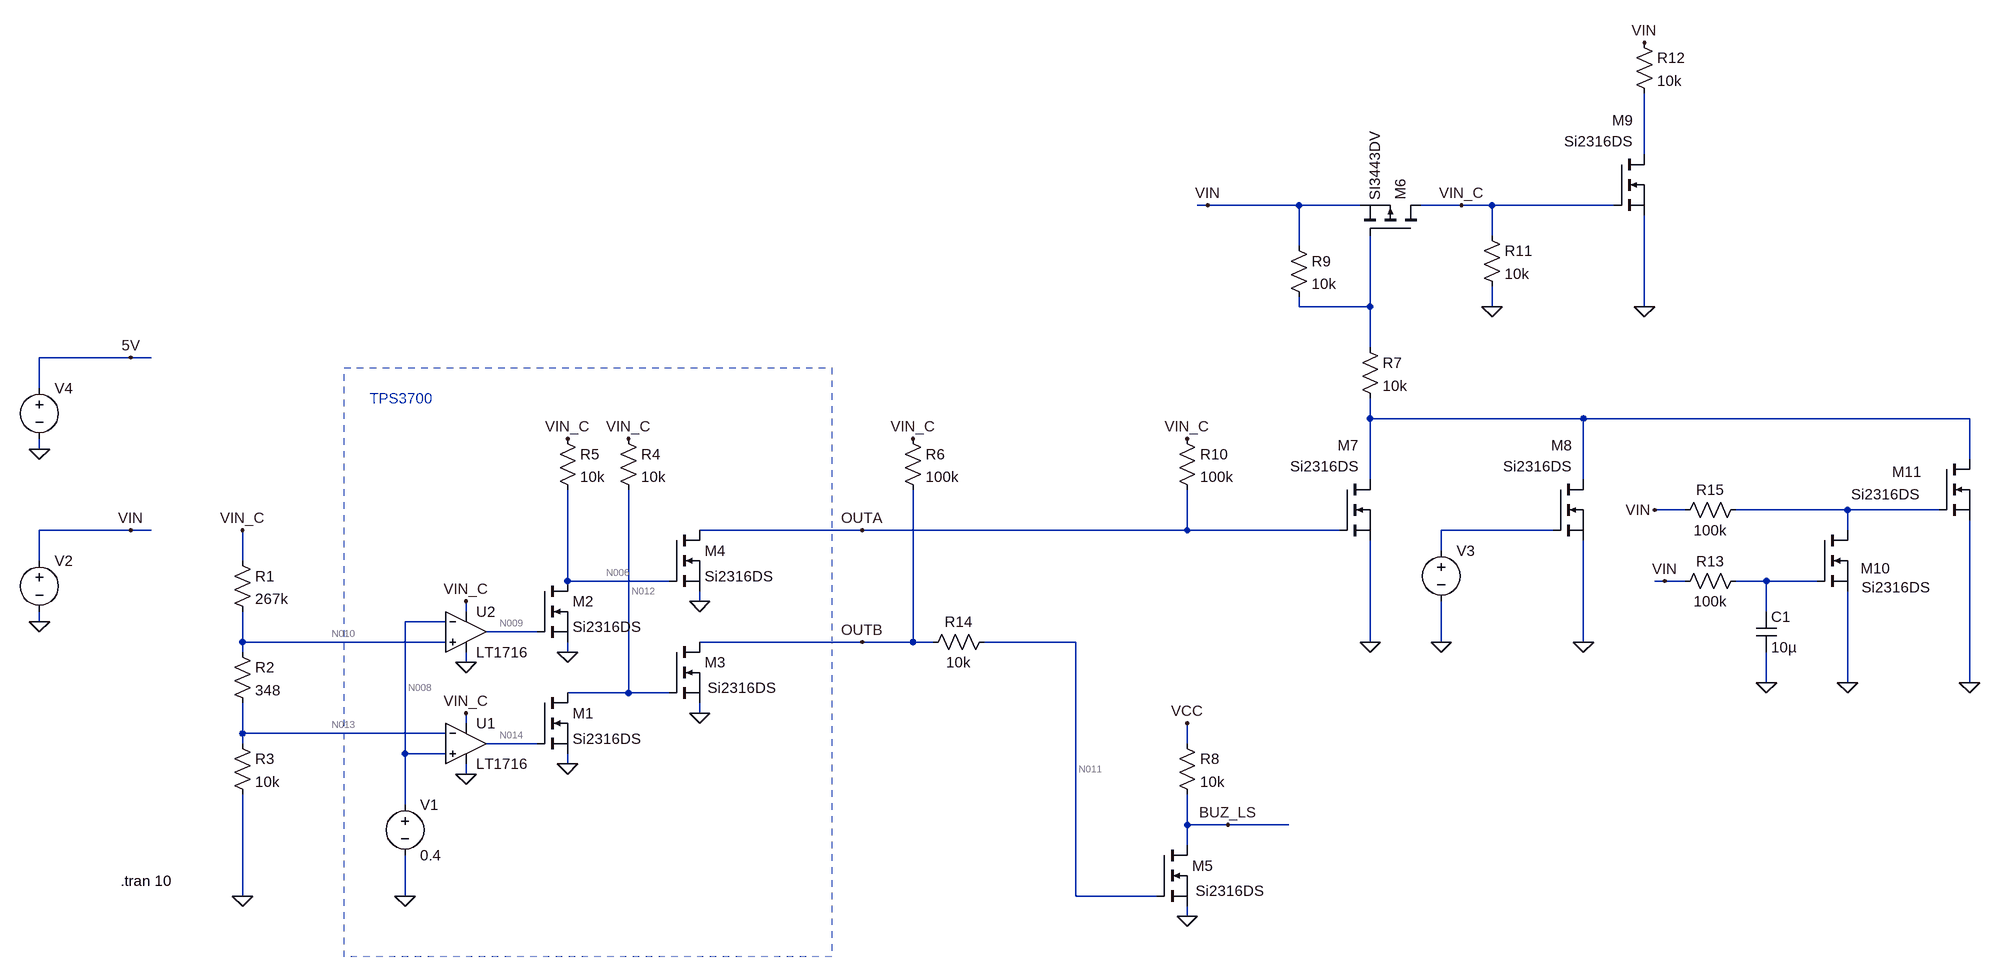
[diagram p0: schematic UVLO_TEST_NEW.asc]
UVLO_TEST_NEW.asc, the LTspice schematic file:
Version 4
SHEET 1 2580 692
WIRE 2048 -576 2048 -672
WIRE 1360 -496 1344 -496
WIRE 1504 -496 1360 -496
WIRE 1600 -496 1504 -496
WIRE 1760 -496 1696 -496
WIRE 1808 -496 1760 -496
WIRE 2000 -496 1808 -496
WIRE 1808 -448 1808 -496
WIRE 1504 -432 1504 -496
WIRE 1504 -336 1504 -352
WIRE 1616 -336 1616 -448
WIRE 1616 -336 1504 -336
WIRE 1808 -336 1808 -368
WIRE 2048 -336 2048 -480
WIRE 1616 -272 1616 -336
WIRE -336 -256 -480 -256
WIRE -304 -256 -336 -256
WIRE -480 -208 -480 -256
WIRE 1616 -160 1616 -192
WIRE 1952 -160 1616 -160
WIRE 2560 -160 1952 -160
WIRE -480 -112 -480 -128
WIRE 2560 -96 2560 -160
WIRE 1616 -64 1616 -160
WIRE 1952 -64 1952 -160
WIRE 2112 -16 2064 -16
WIRE 2368 -16 2192 -16
WIRE 2512 -16 2368 -16
WIRE -336 16 -480 16
WIRE -304 16 -336 16
WIRE 816 16 560 16
WIRE 1328 16 1328 -48
WIRE 1328 16 816 16
WIRE 1568 16 1328 16
WIRE 1904 16 1728 16
WIRE 2368 16 2368 -16
WIRE 1728 48 1728 16
WIRE -480 64 -480 16
WIRE -160 64 -160 16
WIRE 352 96 352 -48
WIRE 512 96 352 96
WIRE 2080 96 2064 96
WIRE 2112 96 2080 96
WIRE 2240 96 2192 96
WIRE 2320 96 2240 96
WIRE 560 128 560 112
WIRE 192 144 192 128
WIRE 2240 144 2240 96
WIRE -480 160 -480 144
WIRE 160 160 96 160
WIRE 304 176 224 176
WIRE -160 192 -160 144
WIRE 160 192 -160 192
WIRE 816 192 560 192
WIRE 896 192 896 -48
WIRE 896 192 816 192
WIRE 928 192 896 192
WIRE 1152 192 1008 192
WIRE 1616 192 1616 32
WIRE 1728 192 1728 128
WIRE 1952 192 1952 32
WIRE -160 208 -160 192
WIRE 352 208 352 192
WIRE 192 224 192 208
WIRE 2240 256 2240 208
WIRE 2368 256 2368 112
WIRE 2560 256 2560 0
WIRE 448 272 448 -48
WIRE 448 272 352 272
WIRE 512 272 448 272
WIRE 560 304 560 288
WIRE 192 320 192 304
WIRE -160 336 -160 288
WIRE 160 336 -160 336
WIRE -160 352 -160 336
WIRE 304 352 224 352
WIRE 1328 352 1328 320
WIRE 96 368 96 160
WIRE 160 368 96 368
WIRE 352 384 352 368
WIRE 192 400 192 384
WIRE 96 448 96 368
WIRE 1328 480 1328 432
WIRE 1392 480 1328 480
WIRE 1488 480 1392 480
WIRE 1328 512 1328 480
WIRE -160 592 -160 432
WIRE 96 592 96 528
WIRE 1152 592 1152 192
WIRE 1280 592 1152 592
WIRE 1328 624 1328 608
FLAG -160 592 0
FLAG -480 160 0
FLAG 96 592 0
FLAG 192 400 0
FLAG 192 224 0
FLAG 192 304 VIN_C
FLAG 192 128 VIN_C
FLAG -160 16 VIN_C
FLAG 352 384 0
FLAG 448 -128 VIN_C
FLAG 352 208 0
FLAG 352 -128 VIN_C
FLAG 560 304 0
FLAG 896 -128 VIN_C
FLAG 560 128 0
FLAG 816 192 OUTB
FLAG 1328 624 0
FLAG 1328 320 VCC
FLAG 816 16 OUTA
FLAG 1392 480 BUZ_LS
FLAG 1728 192 0
FLAG 1952 192 0
FLAG 1616 192 0
FLAG 1360 -496 VIN
FLAG -336 16 VIN
FLAG 1760 -496 VIN_C
FLAG 1328 -128 VIN_C
FLAG 1808 -336 0
FLAG 2048 -336 0
FLAG 2048 -752 VIN
FLAG -480 -112 0
FLAG -336 -256 5V
FLAG 2240 256 0
FLAG 2080 96 VIN
FLAG 2064 -16 VIN
FLAG 2368 256 0
FLAG 2560 256 0
SYMBOL res -176 48 R0
SYMATTR InstName R1
SYMATTR Value 267k
SYMBOL res -176 192 R0
SYMATTR InstName R2
SYMATTR Value 348
SYMBOL res -176 336 R0
SYMATTR InstName R3
SYMATTR Value 10k
SYMBOL voltage 96 432 R0
WINDOW 123 0 0 Left 0
WINDOW 39 0 0 Left 0
SYMATTR InstName V1
SYMATTR Value 0.4
SYMBOL Comparators\\LT1716 192 352 R0
SYMATTR InstName U1
SYMBOL Comparators\\LT1716 192 176 R0
SYMATTR InstName U2
SYMBOL voltage -480 48 R0
WINDOW 3 24 96 Invisible 2
WINDOW 123 0 0 Left 0
WINDOW 39 0 0 Left 0
SYMATTR Value PWL(0 0 0.01 12 3 12 4 10 5 12 6 12 7 10 10 10)
SYMATTR InstName V2
SYMBOL nmos 304 272 R0
SYMATTR InstName M1
SYMATTR Value Si2316DS
SYMBOL res 432 -144 R0
SYMATTR InstName R4
SYMATTR Value 10k
SYMBOL nmos 304 96 R0
SYMATTR InstName M2
SYMATTR Value Si2316DS
SYMBOL res 336 -144 R0
SYMATTR InstName R5
SYMATTR Value 10k
SYMBOL nmos 512 192 R0
WINDOW 3 61 72 Left 2
SYMATTR Value Si2316DS
SYMATTR InstName M3
SYMBOL res 880 -144 R0
SYMATTR InstName R6
SYMATTR Value 100k
SYMBOL nmos 512 16 R0
SYMATTR InstName M4
SYMATTR Value Si2316DS
SYMBOL nmos 1280 512 R0
WINDOW 3 61 72 Left 2
SYMATTR Value Si2316DS
SYMATTR InstName M5
SYMBOL res 1312 336 R0
SYMATTR InstName R8
SYMATTR Value 10k
SYMBOL res 1024 176 R90
WINDOW 0 0 56 VBottom 2
WINDOW 3 32 56 VTop 2
SYMATTR InstName R14
SYMATTR Value 10k
SYMBOL pmos 1696 -448 M270
SYMATTR InstName M6
SYMATTR Value SI3443DV
SYMBOL nmos 1568 -64 R0
WINDOW 3 -78 -21 Left 2
WINDOW 0 -3 -54 Left 2
SYMATTR Value Si2316DS
SYMATTR InstName M7
SYMBOL nmos 1904 -64 R0
WINDOW 3 -78 -21 Left 2
WINDOW 0 -3 -54 Left 2
SYMATTR Value Si2316DS
SYMATTR InstName M8
SYMBOL voltage 1728 32 R0
WINDOW 3 24 96 Invisible 2
WINDOW 123 0 0 Left 0
WINDOW 39 0 0 Left 0
SYMATTR Value PULSE(0 12 1 0.01 0.01 0.1 4)
SYMATTR InstName V3
SYMBOL res 1600 -288 R0
SYMATTR InstName R7
SYMATTR Value 10k
SYMBOL res 1488 -448 R0
SYMATTR InstName R9
SYMATTR Value 10k
SYMBOL res 1312 -144 R0
SYMATTR InstName R10
SYMATTR Value 100k
SYMBOL res 1792 -464 R0
SYMATTR InstName R11
SYMATTR Value 10k
SYMBOL nmos 2000 -576 R0
WINDOW 3 -78 -21 Left 2
WINDOW 0 -3 -54 Left 2
SYMATTR Value Si2316DS
SYMATTR InstName M9
SYMBOL res 2032 -768 R0
SYMATTR InstName R12
SYMATTR Value 10k
SYMBOL voltage -480 -224 R0
WINDOW 3 24 96 Invisible 2
WINDOW 123 0 0 Left 0
WINDOW 39 0 0 Left 0
SYMATTR Value 5
SYMATTR InstName V4
SYMBOL nmos 2320 16 R0
WINDOW 3 70 90 Left 2
WINDOW 0 69 60 Left 2
SYMATTR Value Si2316DS
SYMATTR InstName M10
SYMBOL res 2208 80 R90
WINDOW 0 0 56 VBottom 2
WINDOW 3 32 56 VTop 2
SYMATTR InstName R13
SYMATTR Value 100k
SYMBOL cap 2224 144 R0
SYMATTR InstName C1
SYMATTR Value 10µ
SYMBOL nmos 2512 -96 R0
WINDOW 3 -138 55 Left 2
WINDOW 0 -74 20 Left 2
SYMATTR Value Si2316DS
SYMATTR InstName M11
SYMBOL res 2208 -32 R90
WINDOW 0 0 56 VBottom 2
WINDOW 3 32 56 VTop 2
SYMATTR InstName R15
SYMATTR Value 100k
TEXT -352 568 Left 2 !.tran 10
TEXT 40 -192 Left 2 ;TPS3700
RECTANGLE Normal 0 -240 768 688 1

The netlist it stands for:
* UVLO_TEST_NEW.asc
R1 VIN_C N010 267k
R2 N010 N013 348
R3 N013 0 10k
V1 N008 0 0.4
XU1 N008 N013 VIN_C 0 N014 LT1716  ; pins In+ In- V+ V- OUT
XU2 N010 N008 VIN_C 0 N009 LT1716  ; pins In+ In- V+ V- OUT
V2 VIN 0 PWL(0 0 0.01 12 3 12 4 10 5 12 6 12 7 10 10 10)
M1 N012 N014 0 0 Si2316DS
R4 VIN_C N012 10k
M2 N006 N009 0 0 Si2316DS
R5 VIN_C N006 10k
M3 OUTB N012 0 0 Si2316DS
R6 VIN_C OUTB 100k
M4 OUTA N006 0 0 Si2316DS
M5 BUZ_LS N011 0 0 Si2316DS
R8 VCC BUZ_LS 10k
R14 N011 OUTB 10k
M6 VIN_C N002 VIN VIN SI3443DV
M7 N003 OUTA 0 0 Si2316DS
M8 N003 N005 0 0 Si2316DS
V3 N005 0 PULSE(0 12 1 0.01 0.01 0.1 4)
R7 N002 N003 10k
R9 VIN N002 10k
R10 VIN_C OUTA 100k
R11 VIN_C 0 10k
M9 N001 VIN_C 0 0 Si2316DS
R12 VIN N001 10k
V4 5V 0 5
M10 N004 N007 0 0 Si2316DS
R13 N007 VIN 100k
C1 N007 0 10µ
M11 N003 N004 0 0 Si2316DS
R15 N004 VIN 100k
.model NMOS NMOS
.model PMOS PMOS
.lib standard.mos
.tran 10
* TPS3700
.lib LTC1.lib
.backanno
.end

* Results of the author's LTspice run, read from the files saved beside the schematic
* Operating Point, zero values left out:
*   V(vin_c) = 19.73 µV
*   V(n010) = 35.02 µV
*   V(n013) = 34.43 µV
*   V(n008) = 400 mV
*   V(n014) = -8.245 mV
*   V(n009) = -13.49 µV
*   V(n012) = 19.73 µV
*   V(n006) = 19.73 µV
*   V(outb) = 19.73 µV
*   V(outa) = 19.73 µV
*   V(n011) = 19.73 µV
*   V(5v) = 5 V
*   Id(M6) = 46.28 pA
*   Is(M6) = -46.28 pA
*   I(R11) = 1.973 nA
*   I(R3) = 3.443 nA
*   I(R2) = 1.693 nA
*   I(R1) = -57.24 pA
*   I(V2) = 46.28 pA
*   I(V1) = -3.58 nA
*   Ix(u1:1) = 1.79 nA
*   Ix(u1:2) = -1.75 nA
*   Ix(u1:3) = -285.2 pA
*   Ix(u1:4) = 245.2 pA
*   Ix(u2:1) = -1.75 nA
*   Ix(u2:2) = 1.79 nA
*   Ix(u2:3) = -1.677 nA
*   Ix(u2:4) = 1.637 nA
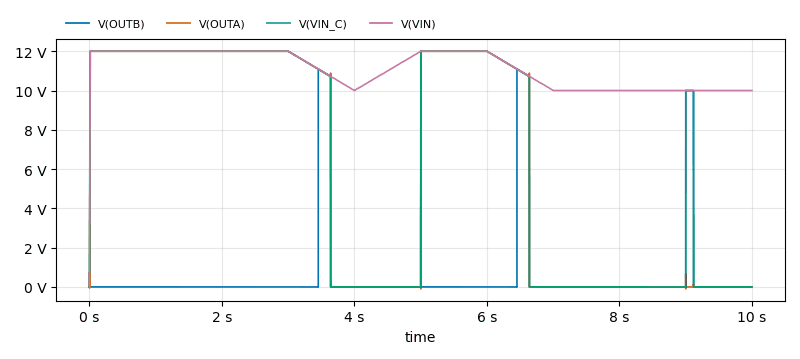
[diagram p1: Transient Analysis of UVLO_TEST_NEW.asc, plotted from the saved traces]
* Transient Analysis, 1 run:
*   V(OUTB): min -11.17 mV, max 11.72 V, average 529.5 mV, rms 2.377 V, last 21.03 µV
*   V(OUTA): min -100.3 mV, max 12 V, average 6.242 V, rms 8.602 V, last 20.93 µV
*   V(VIN_C): min -16.4 mV, max 12 V, average 6.364 V, rms 8.672 V, last 20.93 µV
*   V(VIN): min 0 V, max 12 V, average 11.09 V, rms 11.13 V, last 10 V